# EAGLE design ATmega32u4 (EAGLE 8.6.1)
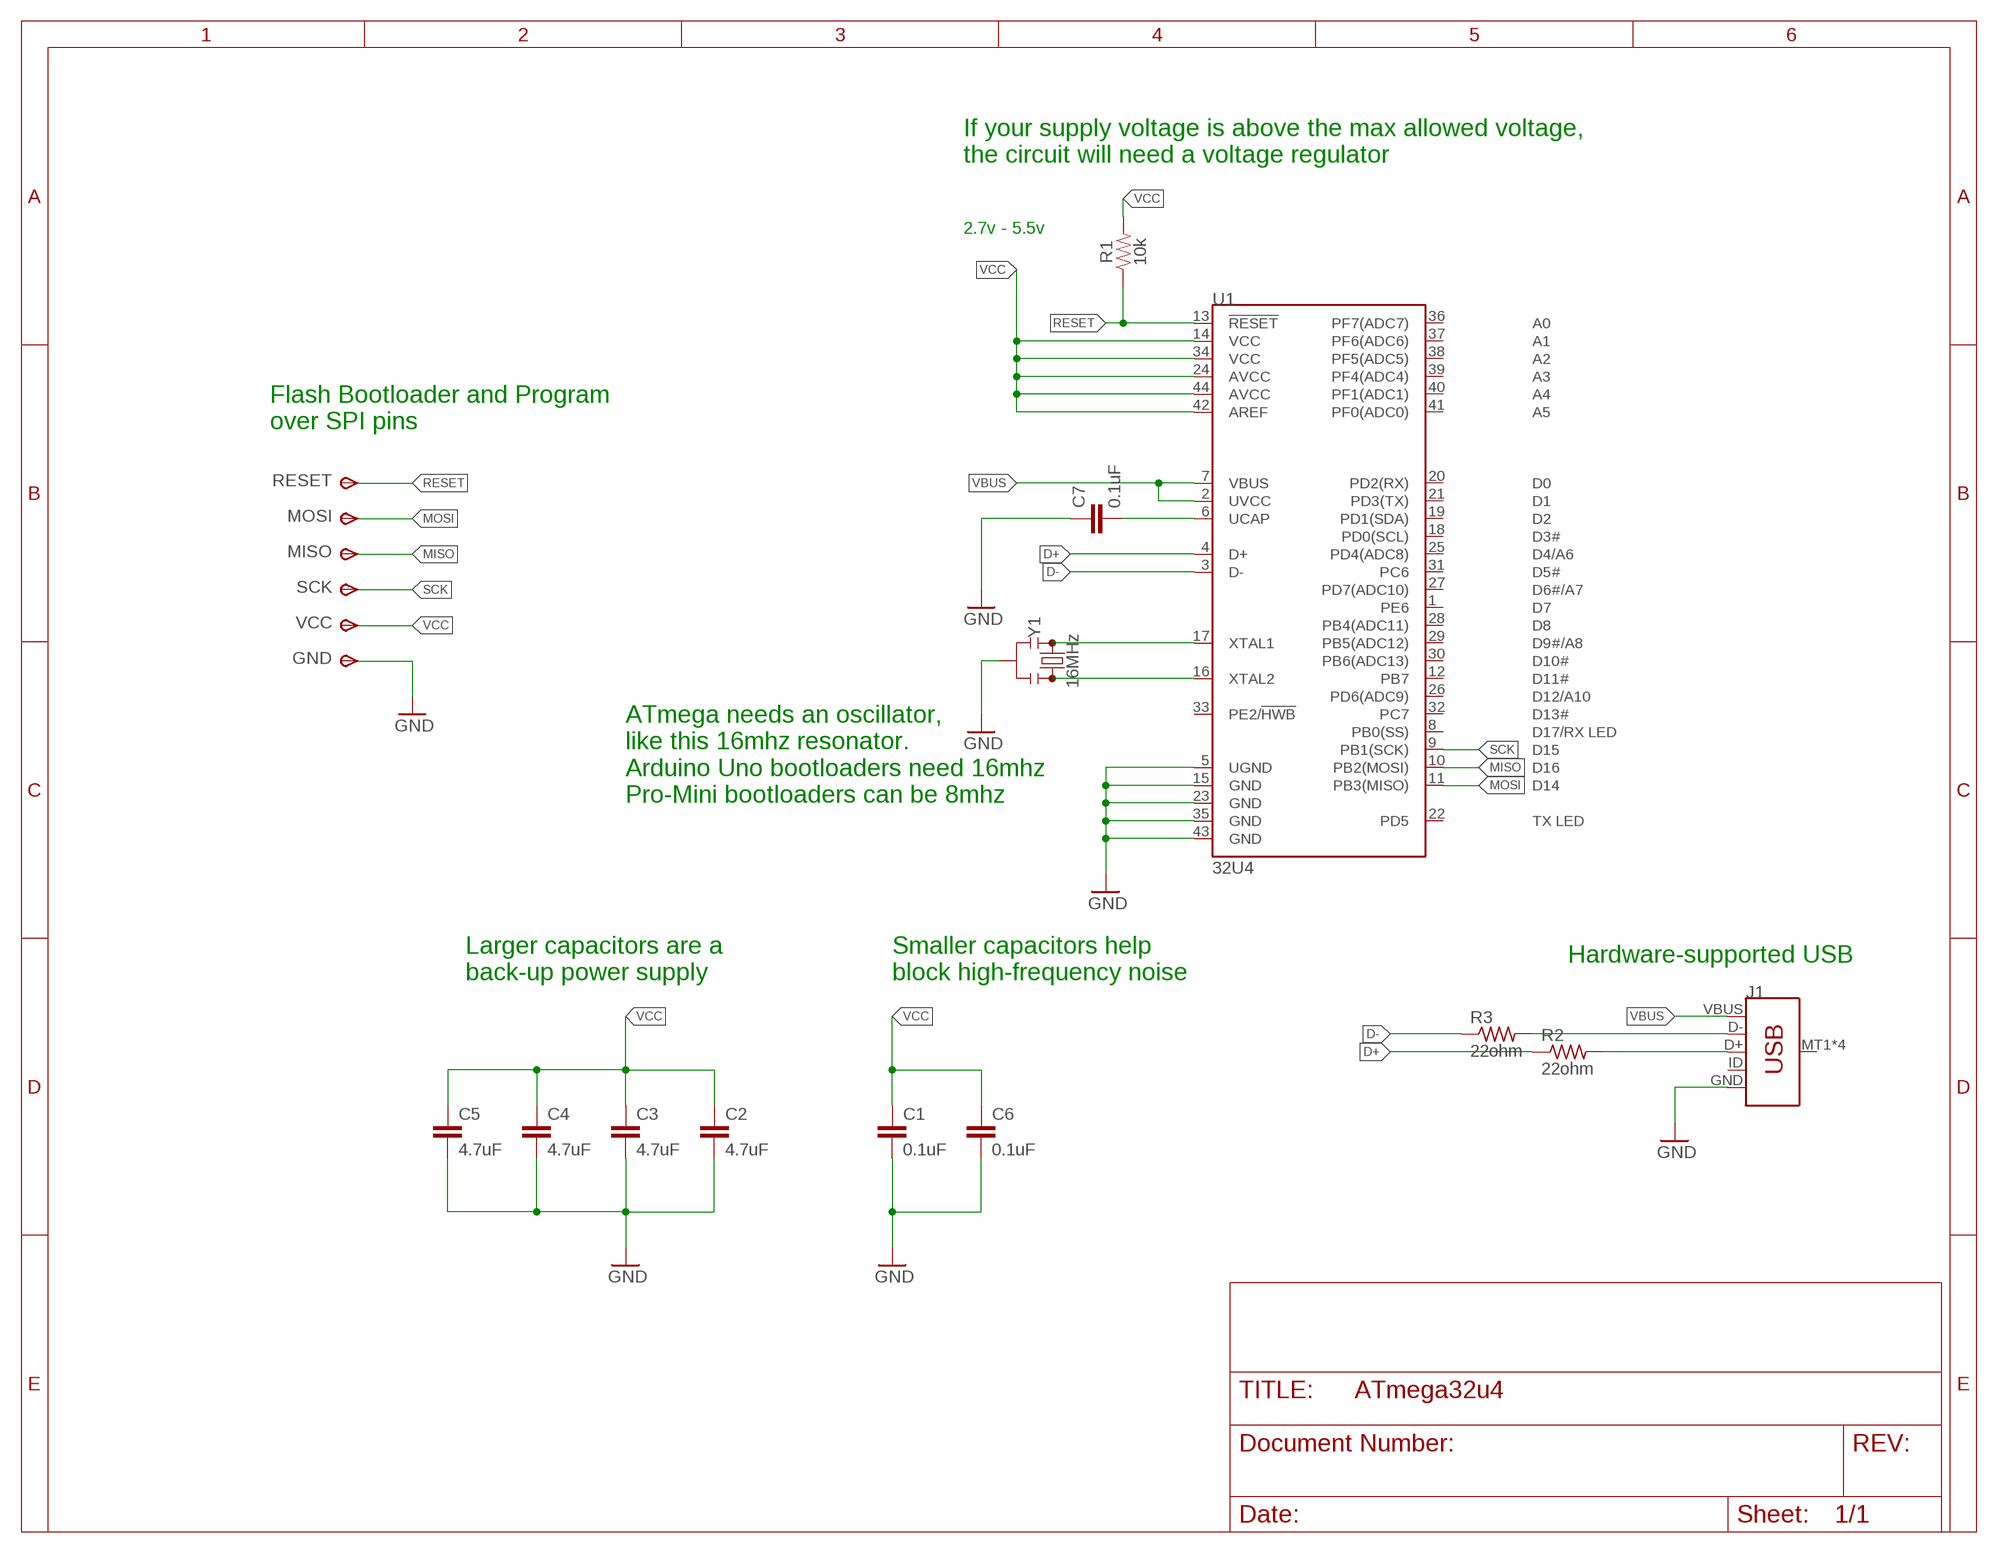
[diagram p0: schematic, sheet 1]

## Parts
C1  0.1uF  0.1UF-0603-25V-5%  [0603]
C2  4.7uF  4.7UF0603  [0603]
C3  4.7uF  4.7UF0603  [0603]
C4  4.7uF  4.7UF0603  [0603]
C5  4.7uF  4.7UF0603  [0603]
C6  0.1uF  0.1UF-0603-25V-5%  [0603]
C7  0.1uF  0.1UF-0603-25V-5%  [0603]
GND  TPSTP14SQ  [TP14SQ]
J1  USB_MICRO-B_SMT  [USB-MICROB]
MISO  TPSTP14SQ  [TP14SQ]
MOSI  TPSTP14SQ  [TP14SQ]
R1  10k  10KOHM-0603-1/10W-1%  [0603]
R2  22ohm  R-US_R0603  [R0603]
R3  22ohm  R-US_R0603  [R0603]
RESET  TPSTP14SQ  [TP14SQ]
SCK  TPSTP14SQ  [TP14SQ]
U1  32U4  ATMEGA32U4TQFP-44  [TQFP44]
VCC  TPSTP14SQ  [TP14SQ]
Y1  16MHz  RESONATOR-16MHZSMD_3.2X1.3  [RESONATOR-SMD-3.2X1.3]

## Nets
D+: R2.1 U1.4(D+)
D-: R3.1 U1.3(D-)
GND: C1.2 C2.2 C3.2 C4.2 C5.2 C6.2 C7.1 GND.TP(PP) J1.GND U1.5(UGND) U1.15(GND) U1.23(GND) U1.35(GND) U1.43(GND) Y1.2
MISO: MISO.TP(PP) U1.10(PB2(MOSI))
MOSI: MOSI.TP(PP) U1.11(PB3(MISO))
N$1: C7.2 U1.6(UCAP)
N$2: U1.17(XTAL1) Y1.1
N$3: U1.16(XTAL2) Y1.3
N$5: J1.D- R3.2
N$6: J1.D+ R2.2
RESET: R1.1 RESET.TP(PP) U1.13(!RESET)
SCK: SCK.TP(PP) U1.9(PB1(SCK))
VBUS: J1.VBUS U1.2(UVCC) U1.7(VBUS)
VCC: C1.1 C2.1 C3.1 C4.1 C5.1 C6.1 R1.2 U1.14(VCC) U1.24(AVCC) U1.34(VCC) U1.42(AREF) U1.44(AVCC) VCC.TP(PP)
Unconnected: J1.ID J1.MT1(SHIELD) J1.MT2(SHIELD) J1.P$1(SHIELD) J1.P$2(SHIELD) U1.1(PE6) U1.8(PB0(SS)) U1.12(PB7) U1.18(PD0(SCL)) U1.19(PD1(SDA)) U1.20(PD2(RX)) U1.21(PD3(TX)) U1.22(PD5) U1.25(PD4(ADC8)) U1.26(PD6(ADC9)) U1.27(PD7(ADC10)) U1.28(PB4(ADC11)) U1.29(PB5(ADC12)) U1.30(PB6(ADC13)) U1.31(PC6) U1.32(PC7) U1.33(PE2/!HWB) U1.36(PF7(ADC7)) U1.37(PF6(ADC6)) U1.38(PF5(ADC5)) U1.39(PF4(ADC4)) U1.40(PF1(ADC1)) U1.41(PF0(ADC0))

## Notes on the sheet
- If your supply voltage is above the max allowed voltage,
  the circuit will need a voltage regulator
- 2.7v - 5.5v
- Flash Bootloader and Program
  over SPI pins
- ATmega needs an oscillator,
  like this 16mhz resonator.
  Arduino Uno bootloaders need 16mhz
  Pro-Mini bootloaders can be 8mhz
- Hardware-supported USB
- Larger capacitors are a
  back-up power supply
- Smaller capacitors help
  block high-frequency noise

## Library data of the parts
C1 C6 C7 = SparkFun-Capacitors:0.1UF: 0.1µF ceramic capacitors A capacitor is a passive two-terminal electrical component used to store electrical energy temporarily in an electric field.; PROD_ID: CAP-08604
C2-C5 = SparkFun-Capacitors:4.7UF: 4.7µF ceramic capacitors A capacitor is a passive two-terminal electrical component used to store electrical energy temporarily in an electric field.; PROD_ID: CAP-08280
GND MISO MOSI RESET SCK VCC = testpad:TPS: TEST PIN
J1 = SparkFun-Connectors:USB_MICRO-B: USB Type Micro-B Connector Male/female and PTH/SMT variants SparkFun Products: SparkFun microB USB Breakout <https://www.sparkfun.com/products/12035> SparkFun USB microB Plug Breakout <https://www.sparkfun.com/products/10031> SparkFun ESP8266 Thing <https://www.sparkfun.com/products/13231>; PROD_ID: CONN-09505; SF_ID: PRT-08533
R1 = SparkFun-Resistors:10KOHM: 10kΩ resistor A resistor is a passive two-terminal electrical component that implements electrical resistance as a circuit element. Resistors act to reduce current flow, and, at the same time, act to lower voltage levels within circuits. - Wikipedia; PROD_ID: RES-00824
R2 R3 = adafruit:R-US_: RESISTOR, American symbol
U1 = SparkFun-IC-Microcontroller:ATMEGA32U4: Atmel MCU, 32KByte Atmel 44-pin 8-bit Microcontroller with 32KBytes of ISP Flash and USB Controller Datasheet <http://cdn.sparkfun.com/datasheets/Dev/Arduino/Boards/ATMega32U4.pdf> SparkFun Products LilyPad Arduino USB - ATmega32U4 Board <https://www.sparkfun.com/products/12049> (DEV-12049) Pro Micro - 5V/16MHz <https://www.sparkfun.com/products/12640> (DEV-12640) Pro Micro - 3.3V/8MHz <https://www.sparkfun.com/products/12587> (DEV-12587) Fio v3 - ATmega32U4 <https://www.sparkfun.com/products/11520> (DEV-11520) Qduino Mini <https://www.sparkfun.com/products/13614> (DEV-13614) Makey Makey - Standard Kit <https://www.sparkfun.com/products/11511> (WIG-11511) Makey Makey Deluxe Kit <https://www.sparkfun.com/products/11519> (WIG-11519); PROD_ID: IC-11161
Y1 = SparkFun-Clocks:RESONATOR-16MHZ: 16MHz Resonator Digikey Example <http://www.digikey.com/product-detail/en/murata-electronics-north-america/CSTCE16M0V53-R0/490-1198-1-ND/584635> Frequency: 16MHz Frequency Stability: ±0.3% Frequency Tolerance: ±0.5% Capacitance: 15pF SparkFun Products SparkFun OpenLog <https://www.sparkfun.com/products/13712> SparkFun MicroView - OLED Arduino Module <https://www.sparkfun.com/products/12923>; PROD_ID: XTAL-08900

## Board
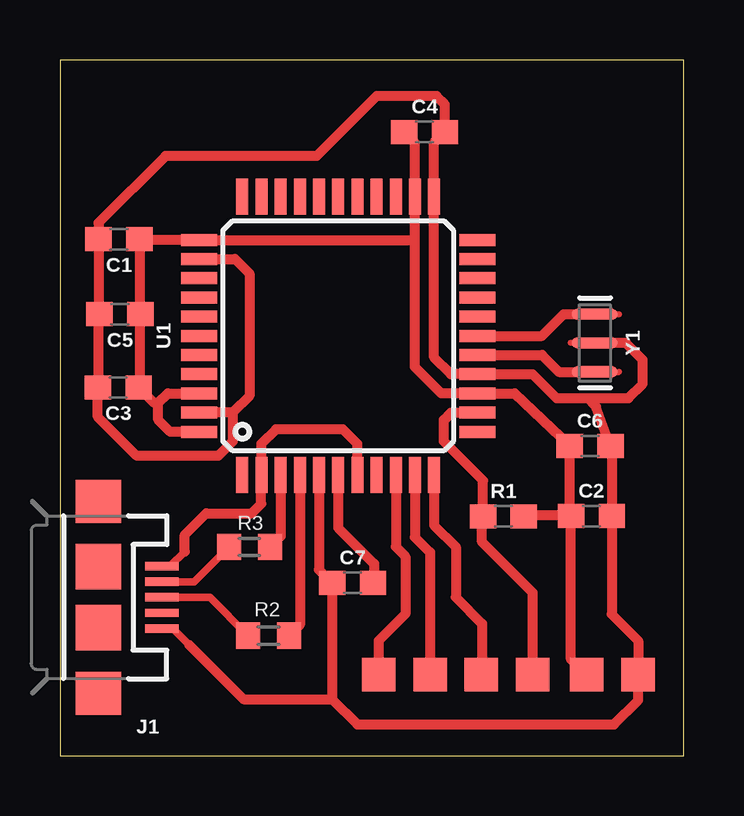
[diagram p1: board, top side]

Size 26 x 29 mm. Coordinates in mm from the lower left corner, seen from the top.
Outline: 0,0 26,0 26,29 0,29 0,0
Copper layers (1*16): Top 0.035mm / dielectric 1.5mm / Bottom 0.035mm
Design rules "OthermillDRC_1_64_v2": minimum track width 16mil, minimum drill 31mil, track to track 0.39878125mm, track to pad 0.39878125mm, pad to pad 0.39878125mm, via to via 0.39878125mm, smd to smd 0mil, copper to edge 0mil, drill to drill 1mil, minimum pad ring 0mil, minimum via ring 15mil, stop-mask expansion 1mil, vias tented up to drill 30mil, thermal gap 10mil

### Footprints (pad centres in the part's own frame; a part is rotated, then mirrored left to right if it is on the bottom)
0603 = smd 1.1 x 1: 1 -0.85,0; 2 0.85,0
TP14SQ = smd 1.4 x 1.4: TP 0,0
USB-MICROB = smd 1.4 x 0.35: D+ -2.65,0; D- -2.65,-0.65; GND -2.65,1.3; ID -2.65,0.65; VBUS -2.65,-1.3 | smd 1.9 x 1.8: MT1 0,-4; MT2 0,4 | smd 1.9 x 1.9: P$1 0,-1.27; P$2 0,1.27
R0603 = smd 1 x 1.1: 1 -0.85,0; 2 0.85,0
TQFP44 = smd 1.5 x 0.5: 1 -5.8,4; 2 -5.8,3.2; 3 -5.8,2.4; 4 -5.8,1.6; 5 -5.8,0.8; 6 -5.8,0; 7 -5.8,-0.8; 8 -5.8,-1.6; 9 -5.8,-2.4; 10 -5.8,-3.2; 11 -5.8,-4; 23 5.8,-4; 24 5.8,-3.2; 25 5.8,-2.4; 26 5.8,-1.6; 27 5.8,-0.8; 28 5.8,0; 29 5.8,0.8; 30 5.8,1.6; 31 5.8,2.4; 32 5.8,3.2; 33 5.8,4 | smd 0.5 x 1.5: 12 -4,-5.8; 13 -3.2,-5.8; 14 -2.4,-5.8; 15 -1.6,-5.8; 16 -0.8,-5.8; 17 0,-5.8; 18 0.8,-5.8; 19 1.6,-5.8; 20 2.4,-5.8; 21 3.2,-5.8; 22 4,-5.8; 34 4,5.8; 35 3.2,5.8; 36 2.4,5.8; 37 1.6,5.8; 38 0.8,5.8; 39 0,5.8; 40 -0.8,5.8; 41 -1.6,5.8; 42 -2.4,5.8; 43 -3.2,5.8; 44 -4,5.8
RESONATOR-SMD-3.2X1.3 = smd 0.45 x 1.905: 1 -1.2,0; 2 0,0; 3 1.2,0

### Placement (x,y rotation side)
C1  2.46,21.53 180 top
C2  22.16,9.98 0 top
C3  2.43,15.35 180 top
C4  15.2,26 0 top
C5  2.5,18.4 180 top
C6  22.1,12.9 0 top
C7  12.2,7.2 0 top
GND  24.11,3.37 0 top
J1  1.6,6.6 180 top
MISO  15.43,3.37 0 top
MOSI  17.57,3.37 0 top
R1  18.49,9.97 0 top
R2  8.7,5 180 top
R3  7.9,8.7 180 top
RESET  19.71,3.37 0 top
SCK  13.29,3.37 0 top
U1  11.6,17.5 90 top
VCC  21.95,3.37 0 top
Y1  22.3,17.2 270 top

### Tracks (layer width: path | path; a pad name or v marks a point on that pad's centre or on a via)
D+
  Top 0.406: U1.4 10,5.45 R2.1
D-
  Top 0.406: U1.3 9.2,9.15 R3.1
GND
  Top 0.305: J1.GND 4.7,5.3 5.4,4.6
  Top 0.406: 22,14.9 20.7,14.9 19.7,15.9 U1.15 16.3,15.9 15.6,16.6 U1.23 15.6,25.55 C4.2 16.05,27.15 15.7,27.5 13.2,27.5 10.7,25 4.4,25 1.6,22.2 1.61,22.19 C1.2 1.61,18.44 | 22,14.9 23.7,14.9 24.3,15.5 24.3,16.5 23.6,17.2 Y1.2 | 1.61,18.44 C5.2 | 22,14.9 22.35,14.55 C6.2 23.01,12.84 C2.2 23.01,5.89 24.11,4.79 GND.TP 24.11,2.31 23.1,1.3 12.4,1.3 11.35,2.35 | U1.5 10.8,7.75 C7.1 11.35,2.35 | 5.4,4.6 7.65,2.35 11.35,2.35 | 1.61,18.44 1.61,15.38 C3.2 1.58,14.12 3.2,12.5 6.6,12.5 7.2,13.1 7.2,14.3 | U1.35 7.3,20.7 7.9,20.1 7.9,15 7.2,14.3 | 7.2,14.3 U1.43
MISO
  Top 0.406: U1.10 14.8,9.1 15.43,8.47 MISO.TP
MOSI
  Top 0.406: U1.11 15.6,9.6 16.5,8.7 16.5,6.6 17.6,5.5 17.6,3.4 MOSI.TP
N$1
  Top 0.406: U1.6 11.6,9.5 13.1,8 13.1,7.25 C7.2
N$2
  Top 0.406: U1.17 20.1,17.5 21,18.4 Y1.1
N$3
  Top 0.406: U1.16 20.1,16.7 20.8,16 Y1.3
N$5
  Top 0.305: J1.D- 5.6,7.25 R3.2
N$6
  Top 0.305: J1.D+ 6.25,6.6 R2.2
RESET
  Top 0.406: U1.13 16.3,14.3 16,14 16,13.1 17.64,11.46 R1.1 17.6,9.93 17.6,8.9 19.71,6.79 RESET.TP
SCK
  Top 0.406: U1.9 14,8.7 14.4,8.3 14.4,5.9 13.29,4.79 SCK.TP
VBUS
  Top 0.305: J1.VBUS 4.6,7.9 5.2,8.5
  Top 0.406: 5.2,8.5 5.2,9.2 6.1,10.1 7.99,10.1 8.39,10.5 U1.2 | U1.2 | U1.7 12.4,13 11.8,13.6 9,13.6 8.39,12.99 U1.2
VCC
  Top 0.406: 14.8,21.4 14.8,16.2 15.9,15.1 U1.14 18.95,15.1 C6.1 21.25,10.04 | 14.8,21.4 U1.24 14.8,25.55 C4.1 | 14.8,21.4 14.7,21.5 U1.34 3.36,21.5 3.35,21.49 | U1.44 4.6,13.5 4.1,14 4.1,14.7 | 4.1,14.7 4.5,15.1 U1.42 | 4.1,14.7 3.93,14.7 C3.1 3.35,15.42 C5.1 3.35,21.49 | 3.35,21.49 C1.1 | VCC.TP 21.31,4.01 C2.1 21.25,10.04 | R1.2 19.41,10.04 21.25,10.04